# EAGLE design Grove-Base Shield v1.2 (EAGLE 5.10)
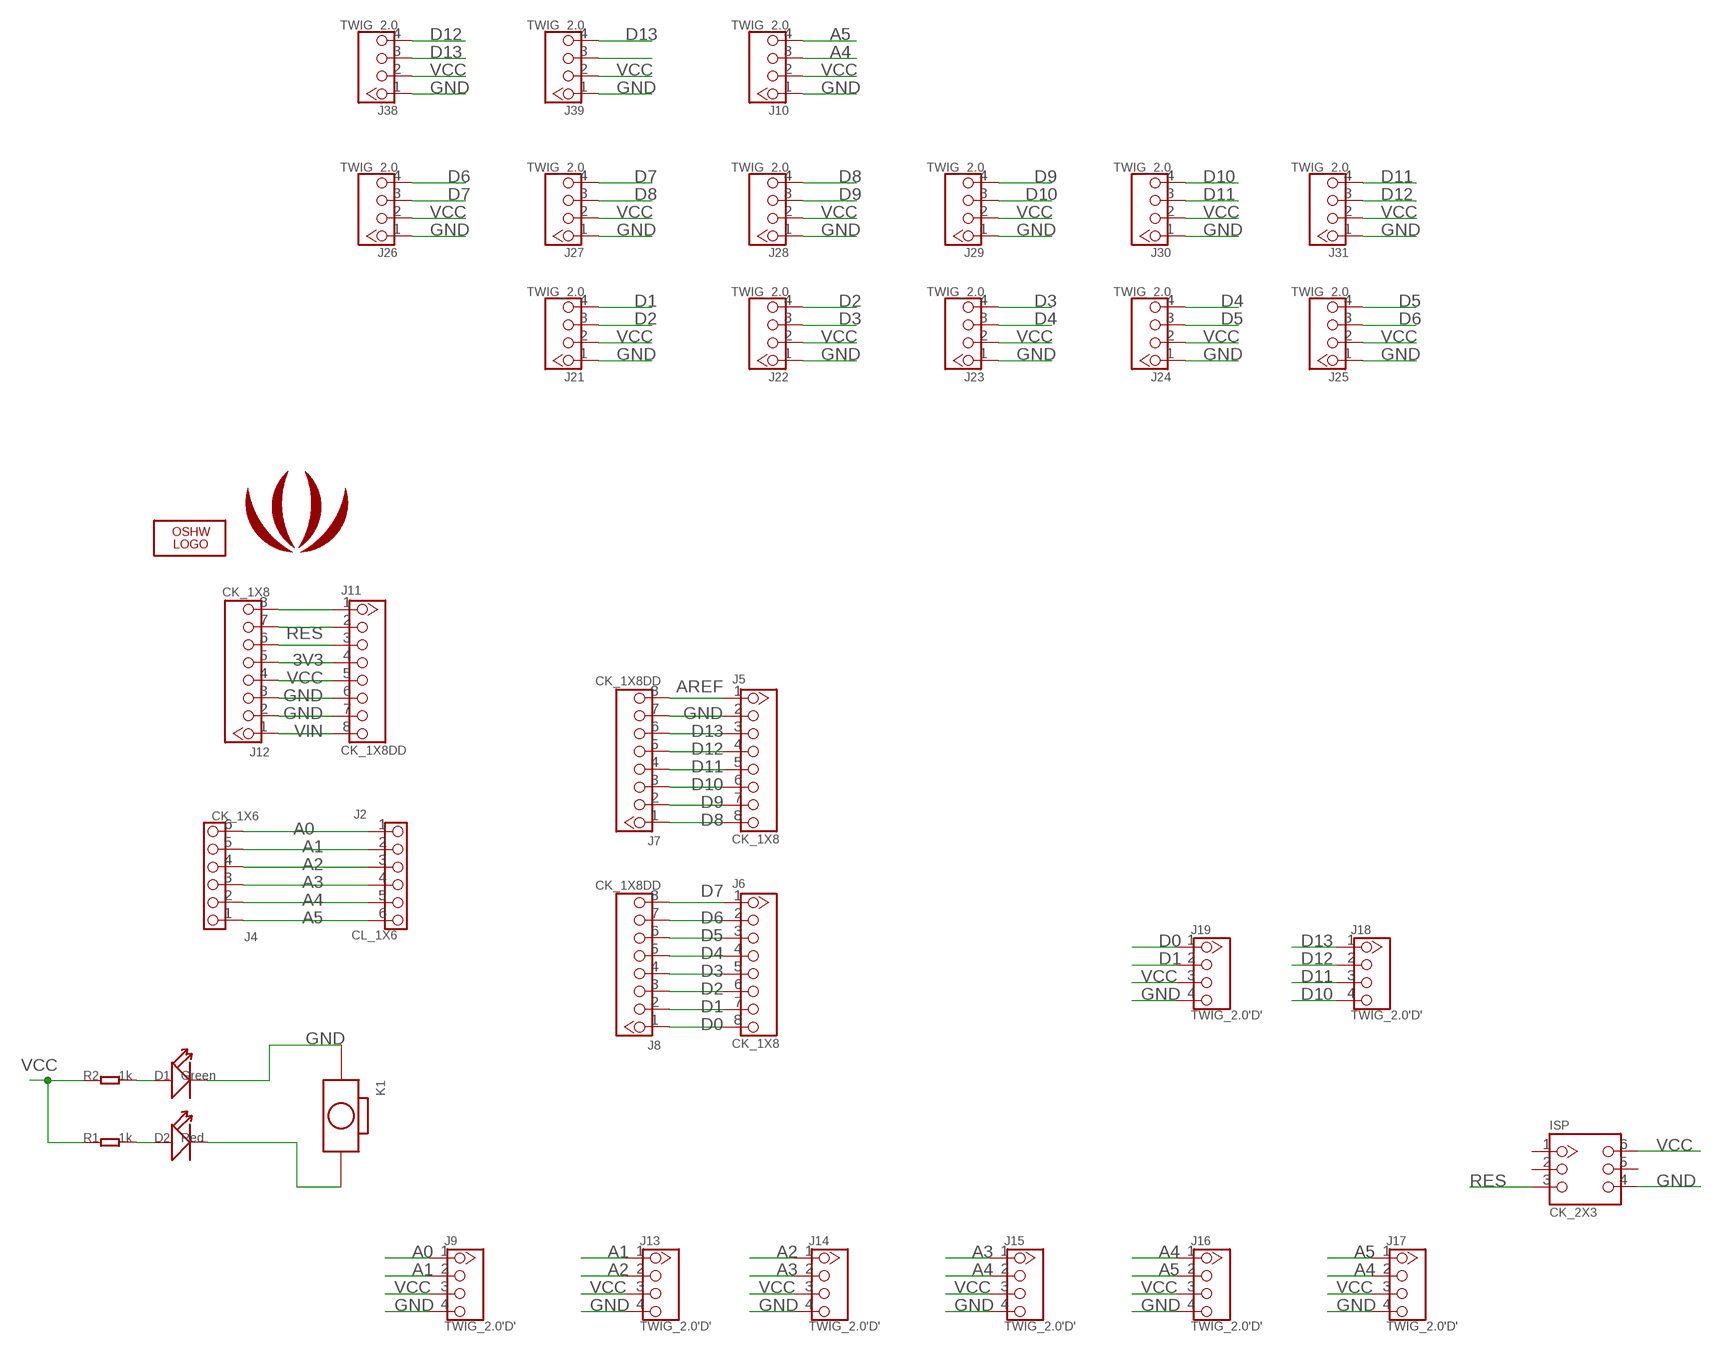
[diagram p0: schematic, sheet 1]

## Parts
D1  Green  007-LED0805  [D0805]
D2  Red  007-LED0805  [D0805]
ISP  CK_2X3  [CK_2X3]
J2  CL_1X6  HEADER-6P-2.54  [6P-2.54]
J4  CK_1X6  HEADER-6P-2.54  [6P-2.54]
J5  CK_1X8  HEADER-8P-55/35MIL  [8P-2.54-55/35MIL]
J6  CK_1X8  HEADER-8P-55/35MIL  [8P-2.54-55/35MIL]
J7  CK_1X8DD  HEADER-8P-55/35MIL  [8P-2.54-55/35MIL]
J8  CK_1X8DD  HEADER-8P-55/35MIL  [8P-2.54-55/35MIL]
J9  TWIG_2.0'D'  [2.0_1X4_90]
J10  TWIG_2.0  [2.0_1X4]
J11  CK_1X8DD  HEADER-8P-55/35MIL  [8P-2.54-55/35MIL]
J12  CK_1X8  HEADER-8P-55/35MIL  [8P-2.54-55/35MIL]
J13  TWIG_2.0'D'  [2.0_1X4_90]
J14  TWIG_2.0'D'  [2.0_1X4_90]
J15  TWIG_2.0'D'  [2.0_1X4_90]
J16  TWIG_2.0'D'  [2.0_1X4_90]
J17  TWIG_2.0'D'  [2.0_1X4_90]
J18  TWIG_2.0'D'  [2.0_1X4_90]
J19  TWIG_2.0'D'  [2.0_1X4_90]
J21  TWIG_2.0  [2.0_1X4]
J22  TWIG_2.0  [2.0_1X4]
J23  TWIG_2.0  [2.0_1X4]
J24  TWIG_2.0  [2.0_1X4]
J25  TWIG_2.0  [2.0_1X4]
J26  TWIG_2.0  [2.0_1X4]
J27  TWIG_2.0  [2.0_1X4]
J28  TWIG_2.0  [2.0_1X4]
J29  TWIG_2.0  [2.0_1X4]
J30  TWIG_2.0  [2.0_1X4]
J31  TWIG_2.0  [2.0_1X4]
J38  TWIG_2.0  [2.0_1X4]
J39  TWIG_2.0  [2.0_1X4]
K1  BOTTON_1_DP  [BTN_5.0_RST]
LOGO1  LOGO-OSHW-FILLX0200-NT  [OSHW_FILLX200_NOTEXT]
R1  1k  005-R0603  [0603]
R2  1k  005-R0603  [0603]
U$1  LOGO-SEEEDSTUDIO-SILK  [LOGO_SILK]

## Nets
3V3: J11.4 J12.5
A0: J2.1 J4.6 J9.1
A1: J2.2 J4.5 J9.2 J13.1
A2: J2.3 J4.4 J13.2 J14.1
A3: J2.4 J4.3 J14.2 J15.1
A4: J2.5 J4.2 J10.3 J15.2 J16.1 J17.2
A5: J2.6 J4.1 J10.4 J16.2 J17.1
AREF: J5.1 J7.8
D0: J6.8 J8.1 J19.1
D1: J6.7 J8.2 J19.2 J21.4
D2: J6.6 J8.3 J21.3 J22.4
D3: J6.5 J8.4 J22.3 J23.4
D4: J6.4 J8.5 J23.3 J24.4
D5: J6.3 J8.6 J24.3 J25.4
D6: J6.2 J8.7 J25.3 J26.4
D7: J6.1 J8.8 J26.3 J27.4
D8: J5.8 J7.1 J27.3 J28.4
D9: J5.7 J7.2 J28.3 J29.4
D10: J5.6 J7.3 J18.4 J29.3 J30.4
D11: J5.5 J7.4 J18.3 J30.3 J31.4
D12: J5.4 J7.5 J18.2 J31.3 J38.4
D13: J5.3 J7.6 J18.1 J38.3 J39.4
GND: D1.- ISP.4 J5.2 J7.7 J9.4 J10.1 J11.6 J11.7 J12.2 J12.3 J13.4 J14.4 J15.4 J16.4 J17.4 J19.4 J21.1 J22.1 J23.1 J24.1 J25.1 J26.1 J27.1 J28.1 J29.1 J30.1 J31.1 J38.1 J39.1 K1.P$1
N$1: D1.+ R2.2
N$3: D2.+ R1.2
N$4: J11.1 J12.8
N$6: J11.2 J12.7
N$41: J39.3
RES: D2.- ISP.3 J11.3 J12.6 K1.P$2
VCC: ISP.6 J9.3 J10.2 J11.5 J12.4 J13.3 J14.3 J15.3 J16.3 J17.3 J19.3 J21.2 J22.2 J23.2 J24.2 J25.2 J26.2 J27.2 J28.2 J29.2 J30.2 J31.2 J38.2 J39.2 R1.1 R2.1
VIN: J11.8 J12.1
Unconnected: ISP.1 ISP.2 ISP.5

## Library data of the parts
D1 D2 = Discrete:007-LED*
ISP = CONNECTER:CK_2X3
J2 J4 = Connector:HEADER-6P
J5-J8 J11 J12 = Connector:HEADER-8P
J9 J10 J13-J19 J21-J31 J38 J39 = CONNECTER:TWIG_2.0
K1 = CPT_SMD:BOTTON_1
LOGO1 = Logo:LOGO-OSHW-FILL
R1 R2 = Discrete:005-R*
U$1 = Logo:LOGO-SEEEDSTUDIO

## Net classes
0 default: width 0.003 mm, drill 0.254 mm, clearance 0.152 mm

## Board
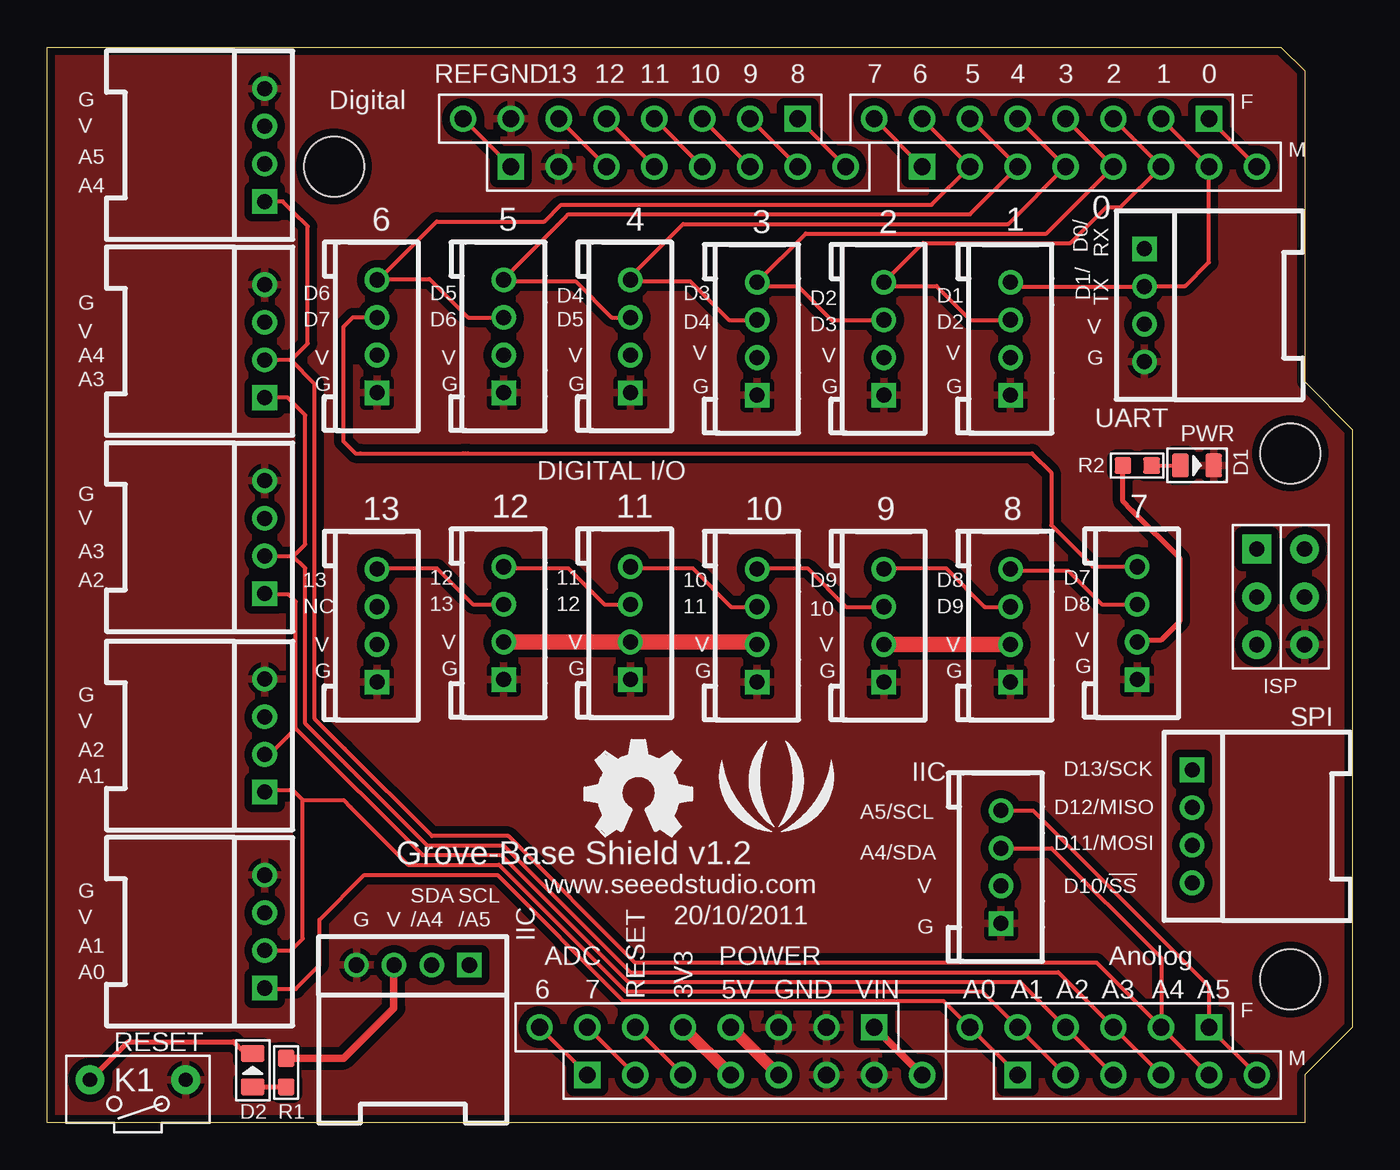
[diagram p1: board, top side]
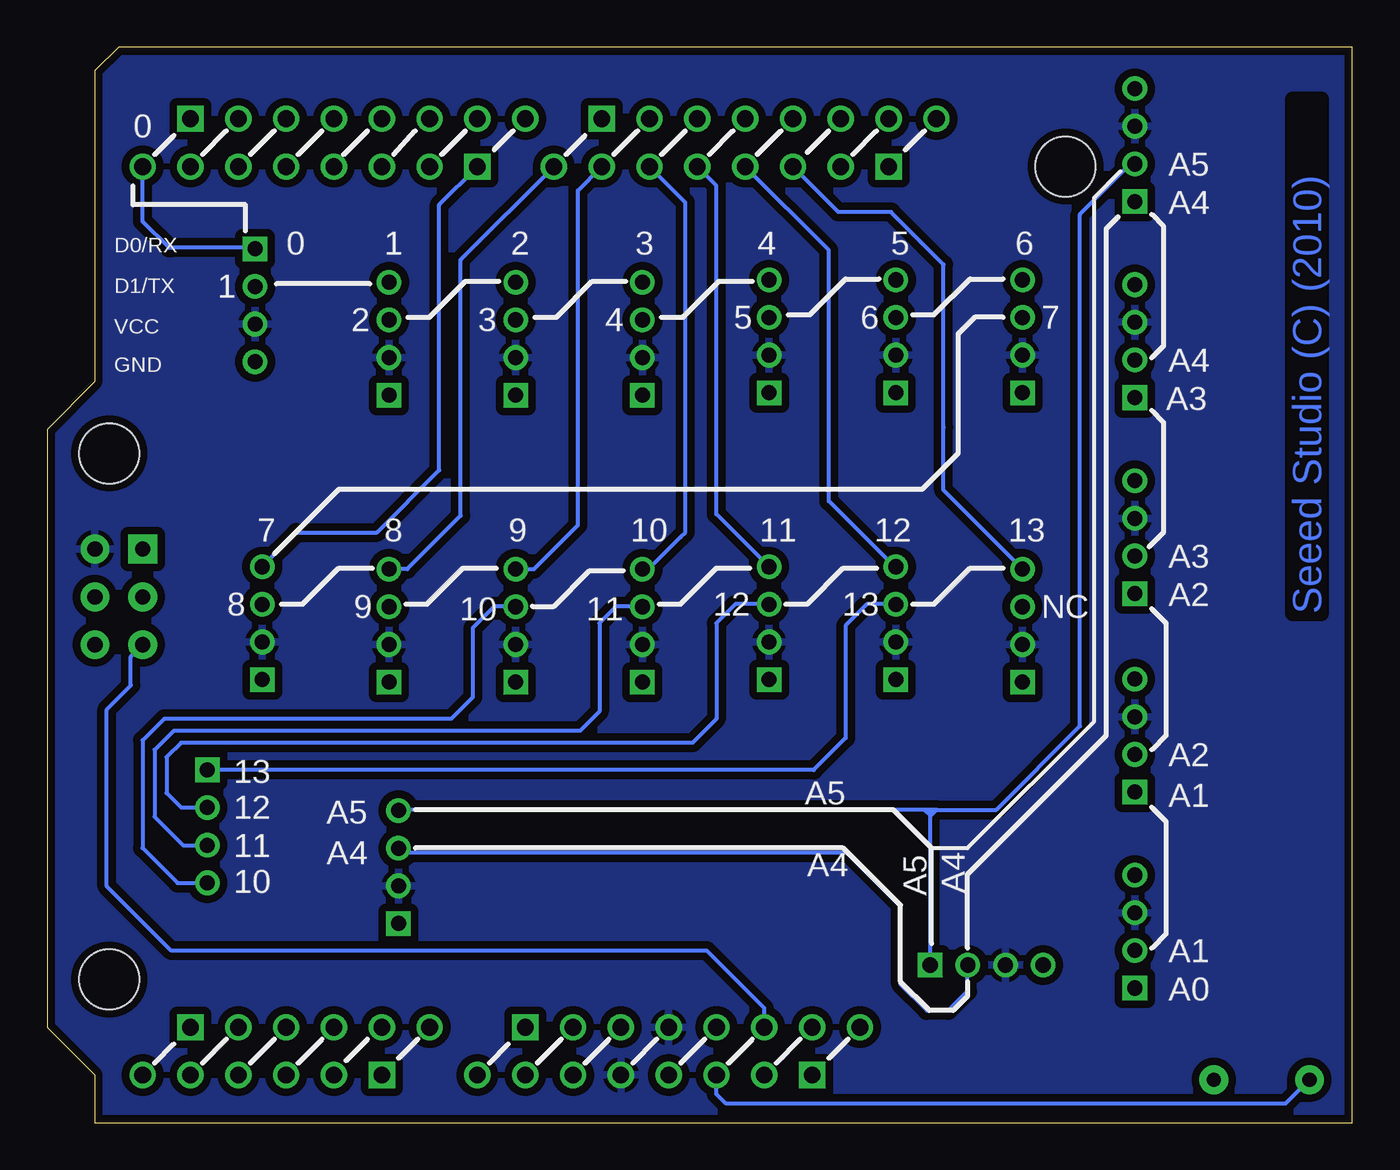
[diagram p2: board, bottom side, seen from below]

Size 69.34 x 57.15 mm. Coordinates in mm from the lower left corner, seen from the top.
Outline: 0,0 0,57.15 65.53,57.15 66.8,55.88 66.8,39.37 69.34,36.83 69.34,5.08 66.8,2.54 66.8,0 0,0
Copper layers (1*16): Top 0.035mm / dielectric 1.5mm / Bottom 0.035mm
Design rules "SeeedStudio_rule_no_angle_090911 *": minimum track width 6mil, minimum drill 12mil, track to track 6mil, track to pad 6mil, pad to pad 6mil, via to via 6mil, smd to smd 0mil, copper to edge 10mil, drill to drill 10mil, minimum pad ring 10mil, minimum via ring 6mil, stop-mask expansion 2mil, vias tented up to drill 100mil, thermal gap 10mil
Holes 3.2 mm at 15.24,50.8 66.04,7.62 66.04,35.56

### Footprints (pad centres in the part's own frame; a part is rotated, then mirrored left to right if it is on the bottom)
D0805 = smd 0.889 x 1.27: + -0.889,0; - 0.889,0
CK_2X3 = drill 0.813 pad 1.524 square: 1 -1.27,2.54 | drill 0.813 pad 1.524 round: 2 -1.27,0; 3 -1.27,-2.54; 4 1.27,-2.54; 5 1.27,0; 6 1.27,2.54
6P-2.54 = drill 0.889 pad 1.397 square: 1 0,6.35 | drill 0.889 pad 1.397 round: 2 0,3.81; 3 0,1.27; 4 0,-1.27; 5 0,-3.81; 6 0,-6.35
8P-2.54-55/35MIL = drill 0.889 pad 1.397 square: 1 0,8.89 | drill 0.889 pad 1.397 round: 2 0,6.35; 3 0,3.81; 4 0,1.27; 5 0,-1.27; 6 0,-3.81; 7 0,-6.35; 8 0,-8.89
2.0_1X4_90 = drill 0.8 pad 1.27 square: 1 -3,0 | drill 0.8 pad 1.27 round: 2 -1,0; 3 1,0; 4 3,0
2.0_1X4 = drill 0.8 pad 1.27 square: 1 -3,0 | drill 0.8 pad 1.27 round: 2 -1,0; 3 1,0; 4 3,0
BTN_5.0_RST = drill 0.762 pad 1.524 round: P$1 0,2.54; P$2 0,-2.54
0603 = smd 0.889 x 0.889: 1 -0.762,0; 2 0.762,0

### Placement (x,y rotation side)
D1  61.09,34.92 0 top
D2  10.92,2.79 90 top
ISP  65.53,27.94 0 top
J2  57.91,2.54 90 top
J4  55.37,5.08 270 top
J5  33.53,50.8 90 top
J6  55.37,50.8 90 top
J7  30.99,53.34 270 top
J8  52.83,53.34 270 top
J9  11.56,10.16 90 top
J10  50.67,13.59 90 top
J11  37.59,2.54 90 top
J12  35.05,5.08 270 top
J13  11.56,20.57 90 top
J14  11.56,31.11 90 top
J15  11.56,41.53 90 top
J16  11.56,51.94 90 top
J17  19.43,8.38 180 top
J18  60.83,15.75 270 top
J19  58.29,43.43 270 top
J21  51.18,41.66 90 top
J22  44.45,41.66 90 top
J23  37.72,41.66 90 top
J24  30.99,41.78 90 top
J25  24.26,41.78 90 top
J26  17.53,41.78 90 top
J27  57.91,26.54 90 top
J28  51.18,26.42 90 top
J29  44.45,26.42 90 top
J30  37.72,26.42 90 top
J31  30.99,26.54 90 top
J38  24.26,26.54 90 top
J39  17.53,26.42 90 top
K1  4.83,2.29 270 top
LOGO1  28.57,15.24 0 top
R1  12.7,2.67 270 top
R2  57.91,34.92 0 top
U$1  38.73,17.14 0 top

### Tracks (layer width: path | path; a pad name or v marks a point on that pad's centre or on a via)
3V3
  Top 0.61: J12.5 J11.4
A0
  Top 0.203: J2.1 J4.6 47.62,6.48 30.61,6.48 23.92,13.16 16.84,13.16 14.48,10.79 14.48,8.38 13.21,7.11 11.61,7.11 J9.1
A1
  Top 0.203: J2.2 J4.5 49.66,6.99 30.73,6.99 24,13.72 19.18,13.72 16.13,16.76 15.75,17.14 13.59,17.14 | J9.2 12.97,9.16 13.59,9.78 13.59,17.14 | 13.59,17.14 13.08,17.65 11.64,17.65 J13.1
A2
  Top 0.203: J2.3 J4.4 51.69,7.49 30.86,7.49 24.13,14.22 19.94,14.22 13.21,20.95 | 13.21,20.95 13.21,27.69 12.83,28.07 11.61,28.07 J14.1 | J13.2 11.83,19.57 13.21,20.95
A3
  Top 0.203: J2.4 J4.3 53.72,8 30.99,8 24.26,14.73 20.19,14.73 15.24,19.68 14.35,20.57 14.22,20.7 13.84,21.08 13.72,21.21 13.72,29.46 13.08,30.1 | 13.08,30.1 11.57,30.1 J14.2 | J15.1 12.78,38.53 13.72,37.59 13.72,30.73 13.08,30.1
A4
  Top 0.203: J4.2 J2.5 | J4.2 55.75,8.51 55.63,8.51 31.24,8.51 24.51,15.24 20.45,15.24 15.81,19.88 | J10.3 53.36,14.59 59.18,8.76 J4.2 | 15.81,19.88 15.75,19.94 | 12.95,40.51 11.57,40.51 J15.2 | J16.1 12.53,48.94 13.08,48.39 13.84,47.62 13.84,41.4 13.02,40.58 | 12.95,40.51 13.02,40.58 | 13.02,40.58 13.08,40.64 | 12.95,40.51 14.22,39.24 14.22,21.46 15.81,19.88
  Bottom 0.203: J10.3 50.44,14.35 26.8,14.35 24,11.56 24,7.49 24,7.37 22.61,5.97 21.46,5.97 20.45,6.99 20.45,8.37 J17.2
A5
  Top 0.203: J2.6 J4.1 61.72,7.24 52.37,16.59 J10.4
  Bottom 0.203: 22.1,16.64 18.92,16.64 14.48,21.08 14.48,48.26 11.79,50.94 J16.2 | 22.1,16.64 22.35,16.64 | 22.35,16.64 22.61,16.64 | 22.73,16.64 22.61,16.64 | 22.73,16.64 50.62,16.64 J10.4 | J17.1 22.43,16.3 | 22.43,16.3 22.1,16.64 | 22.43,16.34 22.43,16.46 | 22.43,16.46 22.61,16.64 | 22.43,16.46 22.43,16.56 22.35,16.64 | 22.43,16.3 22.43,16.34 | 22.43,16.34 22.73,16.64
AREF
  Top 0.203: J7.8 J5.1
D0
  Top 0.203: J6.8 J8.1
  Bottom 0.203: J19.1 58.34,46.48 62.74,46.48 62.87,46.48 64.26,47.88 J6.8
D1
  Top 0.203: J8.2 J6.7 61.72,45.72 60.45,44.45 58.31,44.45 J19.2 51.4,44.43 J21.4
D2
  Top 0.203: J8.3 J6.6 57.02,48.64 56.26,48.64 54.36,46.74 46.53,46.74 J22.4 44.66,44.45 47.24,44.45 49.04,42.66 J21.3
D3
  Top 0.203: J8.4 J6.5 53.09,47.24 40.31,47.24 J23.4 37.92,44.45 39.88,44.45 41.67,42.66 J22.3
D4
  Top 0.203: J8.5 J6.4 51.05,47.75 33.78,47.75 30.99,44.96 J24.4 31.07,44.7 34.16,44.7 36.21,42.66 J23.3
D5
  Top 0.203: J8.6 J6.3 49.02,48.26 27.69,48.26 27.56,48.13 24.26,44.83 J25.4 24.34,44.7 28.07,44.7 29.99,42.78 J24.3
D6
  Top 0.203: J8.7 J6.2 46.99,48.77 27.3,48.77 26.42,47.88 20.7,47.88 17.61,44.78 J26.4 17.57,44.83 20.32,44.83 22.37,42.78 J25.3
D7
  Top 0.203: J6.1 J8.8 | J27.4 55.55,29.54 53.34,31.75 53.34,34.54 52.32,35.56 22.35,35.56 22.23,35.56 22.1,35.56 16.64,35.56 16.38,35.56 15.75,36.2 15.75,42.29 16.26,42.8 17.51,42.8 J26.3
  Bottom 0.203: J27.4 56.09,31.37 51.82,31.37 48.51,34.67 48.51,48.77 J6.1
D8
  Top 0.203: J5.8 J7.1 | J27.3 56.02,27.54 54.23,29.34 51.26,29.34 J28.4
  Bottom 0.203: J28.4 50.21,29.42 47.37,32.26 47.37,45.85 J5.8
D9
  Top 0.203: J5.7 J7.2 | J28.3 49.8,27.42 47.75,29.46 44.5,29.46 J29.4
  Bottom 0.203: J29.4 43.48,29.42 41.15,31.75 41.15,49.53 J5.7
D10
  Top 0.203: J5.6 J7.3 | J29.3 42.43,27.42 40.39,29.46 37.77,29.46 J30.4
  Bottom 0.203: J30.4 37.39,29.42 35.69,31.11 35.43,31.37 35.43,48.9 J5.6 | J18.4 62.41,12.75 64.14,14.48 64.26,14.61 64.26,20.32 63.25,21.34 63.12,21.46 47.88,21.46 46.74,22.61 46.74,26.29 45.59,27.43 44.47,27.43 J29.3
D11
  Top 0.203: J5.5 J7.4 | J30.3 36.34,27.42 34.29,29.46 31.07,29.46 J31.4
  Bottom 0.203: J31.4 33.78,32.34 33.78,35.64 33.78,49.78 J5.5 | J18.3 62.12,14.75 63.63,16.26 63.63,19.81 62.61,20.83 41.02,20.83 40.01,21.84 40.01,26.54 39.12,27.43 37.73,27.43 J30.3
D12
  Top 0.203: J5.4 J7.5 | J31.3 29.61,27.54 27.69,29.46 24.34,29.46 J38.4
  Bottom 0.203: J18.2 62.21,16.75 62.99,17.53 62.99,19.43 62.23,20.19 35.05,20.19 33.78,21.46 33.78,26.54 32.77,27.56 31,27.56 J31.3 | J5.4 27.81,46.35 27.81,33.02 24.34,29.54 J38.4
D13
  Top 0.203: J5.3 J7.6 | J38.3 22.62,27.54 20.7,29.46 17.57,29.46 J39.4
  Bottom 0.203: 17.53,29.46 J39.4 21.72,33.61 21.72,36.96 21.72,45.59 24.51,48.39 27.3,48.39 J5.3 | J18.1 28.62,18.75 26.92,20.45 26.92,26.42 25.78,27.56 24.27,27.56 J38.3
GND
  pour Top (isolate 0.406): -0.13,57.28 70.48,57.15 69.85,0 -0.25,0
N$1
  Top 0.203: R2.2 D1.+
N$3
  Top 0.254: D2.+ R1.2
N$4
  Top 0.203: J11.1 J12.8
N$6
  Top 0.203: J11.2 J12.7
RES
  Top 0.203: J11.3 J12.6 J11.3
  Top 0.254: D2.- 10.54,3.68 9.91,4.32 4.83,4.32 4.32,4.32 K1.P$2
  Bottom 0.203: J12.6 31.24,6.1 34.29,9.14 60.33,9.14 62.74,9.14 66.17,12.57 66.17,21.97 64.9,23.24 64.9,24.77 ISP.3 | J11.3 33.78,1.52 33.27,1.02 4.06,1.02 3.56,1.02 K1.P$2
VCC
  Top 0.254: J27.2 58.02,25.65 59.18,25.65 60.2,26.67 60.2,29.97 57.66,32.51 57.15,33.02 R2.1
  Top 0.406: R1.1 15.75,3.43 18.41,6.1 18.41,8.37 J17.3
  Top 0.61: J12.4 J11.5
  Top 0.813: J38.2 J31.2 37.59,25.54 J30.2 | J29.2 J28.2
  pour Bottom (isolate 0.406): -0.25,57.4 70.61,57.28 69.85,0 -0.25,0
VIN
  Top 0.406: J12.1 J11.8

### Text on the board
Bottom: Seeed Studio (C) (2010)
tPlace: REF | GND | 13 | 12 | 11 | 10 | 9 | 8 | 7 | 6 | 5 | 4 | 3 | 2 | 1 | 0 | G | Digital | F | V | A5 | M | A4 | D0/ | 0 | 6 | 5 | 4 | 3 | 2 | 1 | RX | D1/ | D6 | D5 | D4 | D3 | D1 | G | D2 | TX | V | D7 | D6 | D5 | D4 | D3 | D2 | V | V | V | A4 | V | V | V | V | G | A3 | G | G | G | G | G | G | UART | PWR | DIGITAL I/O | G | V | 13 | 12 | 11 | 10 | 9 | 8 | 7 | A3 | 12 | 11 | D7 | A2 | 13 | 10 | D9 | D8 | NC | 13 | 12 | 11 | 10 | D9 | D8 | V | V | V | V | V | V | V | G | G | G | G | G | G | G | G | V | SPI | A2 | IIC | A1 | D13/SCK | A5/SCL | D12/MISO | Grove-Base Shield v1.2 | A4/SDA | D11/MOSI | G | SDA | SCL | www.seeedstudio.com | V | D10/!SS | V | 20/10/2011 | G | V | /A4 | /A5 | IIC | G | A1 | A0 | ADC | POWER | Anolog | 6 | 7 | RESET | 3V3 | 5V | GND | VIN | A0 | A1 | A2 | A3 | A4 | A5 | F | RESET | M
bPlace: 0 | A5 | A4 | 6 | 5 | 4 | 3 | 2 | 1 | 0 | D0/RX | 1 | D1/TX | 6 | 5 | 4 | 3 | 2 | 7 | VCC | A4 | GND | A3 | 13 | 12 | 11 | 10 | 9 | 8 | 7 | A3 | 13 | 12 | 11 | 10 | 9 | 8 | A2 | NC | A2 | A5 | 13 | A1 | A5 | 12 | A4 | A4 | 11 | A4 | A5 | 10 | A1 | A0